# EAGLE schematic mimic1567heatSink (EAGLE 7.5.0)
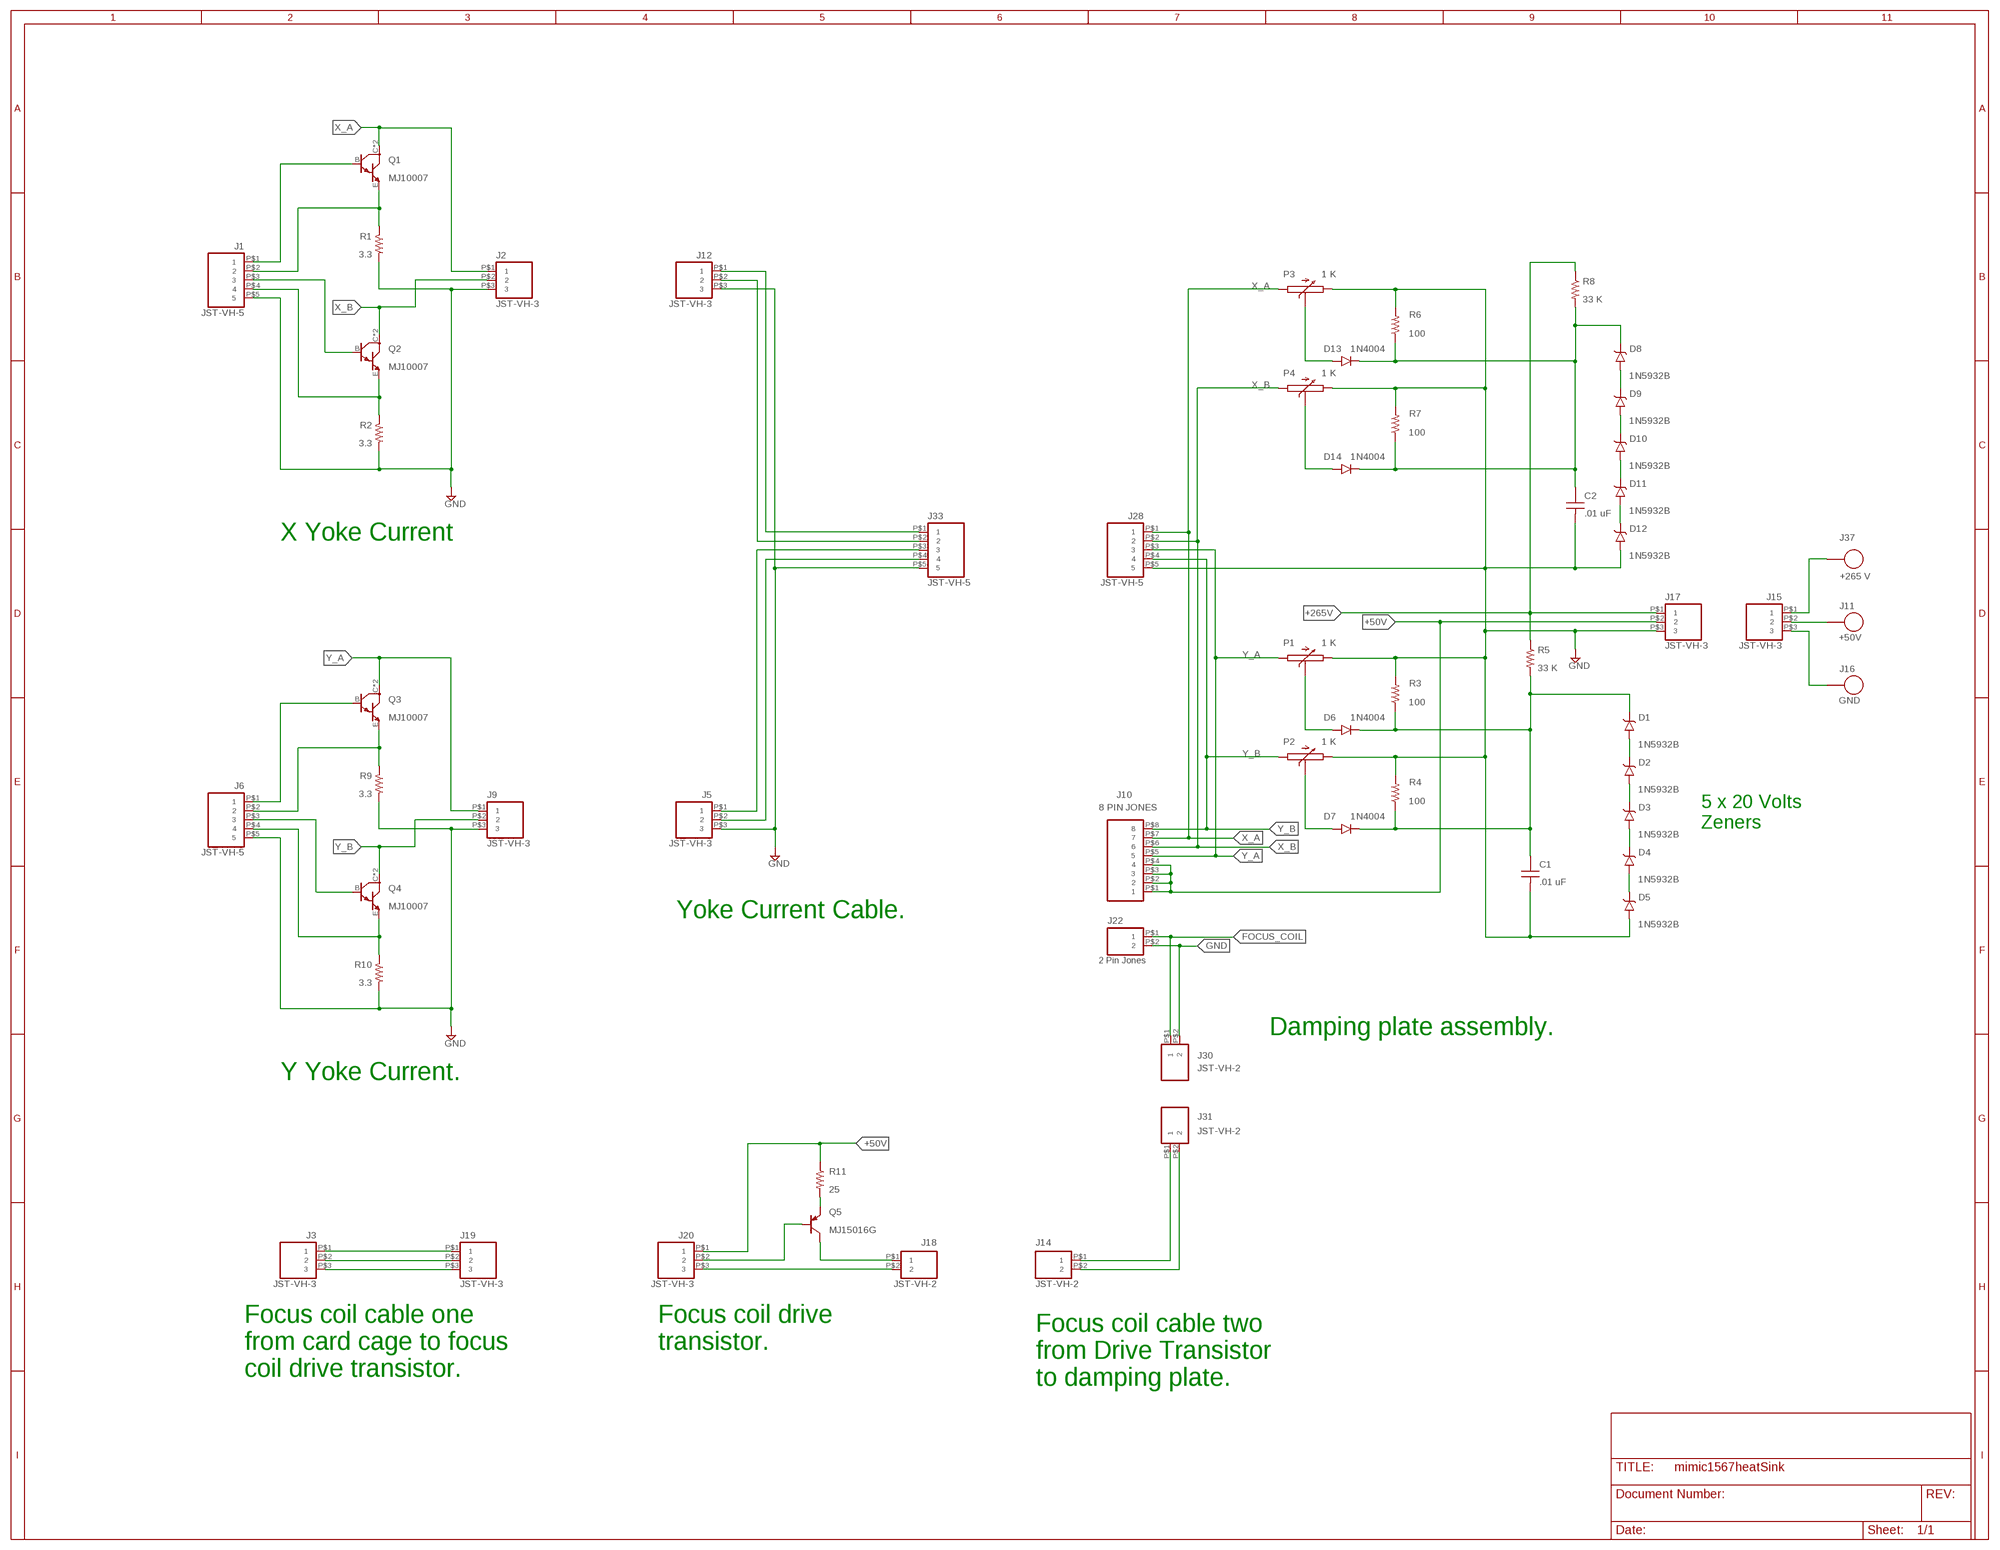
[diagram p0: schematic, sheet 1]

## Parts
C1  .01 uF  FKP1J021004D  [CAP/RADIAL/15MM]
C2  .01 uF  FKP1J021004D  [CAP/RADIAL/15MM]
D1  1N5932B  [DO41]
D2  1N5932B  [DO41]
D3  1N5932B  [DO41]
D4  1N5932B  [DO41]
D5  1N5932B  [DO41]
D6  1N4004  1N400X  [DO-41-10]
D7  1N4004  1N400X  [DO-41-10]
D8  1N5932B  [DO41]
D9  1N5932B  [DO41]
D10  1N5932B  [DO41]
D11  1N5932B  [DO41]
D12  1N5932B  [DO41]
D13  1N4004  1N400X  [DO-41-10]
D14  1N4004  1N400X  [DO-41-10]
J1  JST-VH-5  [VHR-5N]
J2  JST-VH-3  [VHR-3N]
J3  JST-VH-3  [VHR-3N]
J5  JST-VH-3  [VHR-3N]
J6  JST-VH-5  [VHR-5N]
J9  JST-VH-3  [VHR-3N]
J10  8 PIN JONES  8PIN_JONES_PLUG  [8PIN_JONES]
J11  +50V  AWG18  [AWG18]
J12  JST-VH-3  [VHR-3N]
J14  JST-VH-2  [VHR-2N]
J15  JST-VH-3  [VHR-3N]
J16  GND  AWG18  [AWG18]
J17  JST-VH-3  [VHR-3N]
J18  JST-VH-2  [VHR-2N]
J19  JST-VH-3  [VHR-3N]
J20  JST-VH-3  [VHR-3N]
J22  2 Pin Jones  2PIN_JONE_PLUG  [2PIN_JONES]
J28  JST-VH-5  [VHR-5N]
J30  JST-VH-2  [VHR-2N]
J31  JST-VH-2  [VHR-2N]
J33  JST-VH-5  [VHR-5N]
J37  +265 V  AWG18  [AWG18]
P1  1 K  2WATT_POT  [2W_POT]
P2  1 K  2WATT_POT  [2W_POT]
P3  1 K  2WATT_POT  [2W_POT]
P4  1 K  2WATT_POT  [2W_POT]
Q1  MJ10007  [TO3]
Q2  MJ10007  [TO3]
Q3  MJ10007  [TO3]
Q4  MJ10007  [TO3]
Q5  MJ15016G  [TO3]
R1  3.3  RES3R3150W  [R_150WATT]
R2  3.3  RES3R3150W  [R_150WATT]
R3  100  R-1/2WATT  [0309/12]
R4  100  R-1/2WATT  [0309/12]
R5  33 K  R-2WATT  [2WATT/15]
R6  100  R-1/2WATT  [0309/12]
R7  100  R-1/2WATT  [0309/12]
R8  33 K  R-2WATT  [2WATT/15]
R9  3.3  RES3R3150W  [R_150WATT]
R10  3.3  RES3R3150W  [R_150WATT]
R11  25  RH-25-RESISTOR  [DALE-RH]

## Nets
+50V: J10.P$1 J10.P$2 J10.P$3 J10.P$4 J17.P$2 J20.P$1 R11.1
+265V: J17.P$1 R5.1 R8.1
FOCUS_COIL: J18.P$1 J22.P$1 J30.P$1 Q5.C Q5.C/(C)
GND: C1.P$2 C2.P$2 D5.A D12.A J1.P$5 J2.P$3 J5.P$3 J6.P$5 J9.P$3 J12.P$3 J17.P$3 J18.P$2 J20.P$3 J22.P$2 J28.P$5 J30.P$2 J33.P$5 P1.E P2.E P3.E P4.E R1.P$2 R2.P$2 R3.2 R4.2 R6.2 R7.2 R9.P$2 R10.P$2
N$1: J20.P$2 Q5.B
N$2: J1.P$1 Q1.B
N$3: J1.P$2 Q1.E R1.P$1
N$4: Q5.E R11.2
N$5: J1.P$4 Q2.E R2.P$1
N$6: J1.P$3 Q2.B
N$7: J3.P$3 J19.P$3
N$8: J3.P$2 J19.P$2
N$9: D1.A D2.C
N$10: D2.A D3.C
N$11: D3.A D4.C
N$12: D4.A D5.C
N$13: J15.P$1 J37.P$1
N$14: C1.P$1 D1.C D6.C D7.C R3.1 R4.1 R5.2
N$15: D6.A P1.S
N$16: J11.P$1 J15.P$2
N$17: J15.P$3 J16.P$1
N$18: D8.A D9.C
N$19: D7.A P2.S
N$20: J6.P$3 Q4.B
N$21: D9.A D10.C
N$22: D10.A D11.C
N$23: D11.A D12.C
N$24: J14.P$2 J31.P$2
N$25: J3.P$1 J19.P$1
N$26: J6.P$1 Q3.B
N$27: C2.P$1 D8.C D13.C D14.C R6.1 R7.1 R8.2
N$28: J6.P$2 Q3.E R9.P$1
N$29: D13.A P3.S
N$32: J14.P$1 J31.P$1
N$33: D14.A P4.S
N$36: J6.P$4 Q4.E R10.P$1
X_A: J2.P$1 J10.P$7 J12.P$1 J28.P$1 J33.P$1 P3.A Q1.C Q1.C/(C)
X_B: J2.P$2 J10.P$6 J12.P$2 J28.P$2 J33.P$2 P4.A Q2.C Q2.C/(C)
Y_A: J5.P$1 J9.P$1 J10.P$5 J28.P$3 J33.P$3 P1.A Q3.C Q3.C/(C)
Y_B: J5.P$2 J9.P$2 J10.P$8 J28.P$4 J33.P$4 P2.A Q4.C Q4.C/(C)

## Notes on the sheet
- X Yoke Current
- 5 x 20 Volts
  Zeners
- Yoke Current Cable.
- Damping plate assembly.
- Y Yoke Current.
- Focus coil drive 
  transistor.
- Focus coil cable one 
  from card cage to focus 
  coil drive transistor.
- Focus coil cable two 
  from Drive Transistor 
  to damping plate.

## Library data of the parts
C1 C2 = keiths:FKP1J021004D: Film Capacitor 0.01 F 630 VDC Dim: 7x14x18 Lead Spacing:15
D1-D5 D8-D12 = keiths:1N5932B: 3 W DO−41 Zener Voltage Regulators
D6 D7 D13 D14 = keiths:1N400X: 1N4001 - 1N4007 general purpose rectifier
J1 J6 J28 J33 = keiths:JST-VH-5: JST CONN HEADER VH SIDE 5POS 3.96MM
J2 J3 J5 J9 J12 J15 J17 J19 J20 = keiths:JST-VH-3: JST CONN HEADER VH SIDE 3POS 3.96MM
J10 = keiths:8PIN_JONES_PLUG: 8 pin Jones plug.
J11 J16 J37 = keiths:AWG18: AWG18 Wire Hole
J14 J18 J30 J31 = keiths:JST-VH-2: JST CONN HEADER VH SIDE 2POS 3.96MM
J22 = keiths:2PIN_JONE_PLUG: 2 pin Jones plug.
P1-P4 = keiths:2WATT_POT: Panel Mount 2 W pot. RV4NAYSD102A is 1K part number.
Q1-Q4 = keiths:MJ10007: NPN Darlington; PN: MJ10007
Q5 = keiths:MJ15016G: PNP Transistor
R1 R2 R9 R10 = keiths:RES3R3150W: 150W Wirewound Chassis Mount Resistor
R3 R4 R6 R7 = keiths:R-1/2WATT: Half watt through hole resistor.
R5 R8 = keiths:R-2WATT: 2 WATT through hole resistor
R11 = keiths:RH-25-RESISTOR: Heatsink Encased Wirewound Power Resistors 25W